# EAGLE design 20210419-JGaylord-doorman_adult_rig (EAGLE 9.6.2)
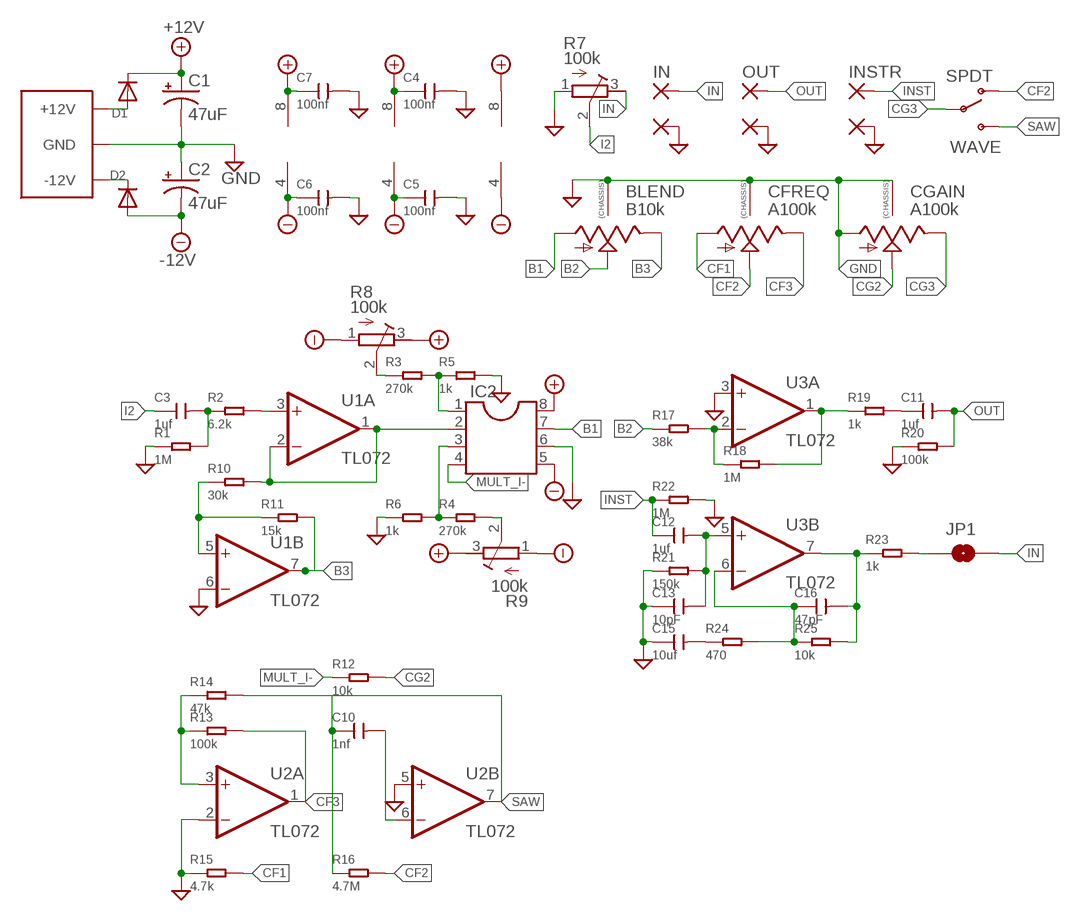
[diagram p0: schematic, sheet 1]

## Parts
BLEND  B10k  9MM_SNAP-IN_POT_CHASSIS  [9MM_SNAP-IN_POT]
C1  47uF  CAP_SMD+THRUPAN_B  [PAN_B_SMD+THRU]
C2  47uF  CAP_SMD+THRUPAN_B  [PAN_B_SMD+THRU]
C3  1uf  CERAMIC-10UF-25V-10%-X5R(1206)  [C1206]
C4  100nf  CERAMIC-100NF-50V-10%-X7R(0805)  [C0805]
C5  100nf  CERAMIC-100NF-50V-10%-X7R(0805)  [C0805]
C6  100nf  CERAMIC-100NF-50V-10%-X7R(0805)  [C0805]
C7  100nf  CERAMIC-100NF-50V-10%-X7R(0805)  [C0805]
C10  1nf  CERAMIC-100NF-50V-10%-X7R(0805)  [C0805]
C11  1uf  CERAMIC-10UF-25V-10%-X5R(1206)  [C1206]
C12  1uf  CERAMIC-10UF-25V-10%-X5R(1206)  [C1206]
C13  10pF  CERAMIC-100NF-50V-10%-X7R(0805)  [C0805]
C15  10uf  CERAMIC-10UF-25V-10%-X5R(1206)  [C1206]
C16  47pF  CERAMIC-100NF-50V-10%-X7R(0805)  [C0805]
CFREQ  A100k  9MM_SNAP-IN_POT_CHASSIS  [9MM_SNAP-IN_POT]
CGAIN  A100k  9MM_SNAP-IN_POT_CHASSIS  [9MM_SNAP-IN_POT]
D1  DIODESOD-123  [SOD-123]
D2  DIODESOD-123  [SOD-123]
GND  WIREPAD1,6/0,9  [1,6/0,9]
GND1  WIREPAD1,6/0,9  [1,6/0,9]
GND2  WIREPAD1,6/0,9  [1,6/0,9]
IC2  DIL8  [DIL08]
IN  WIREPAD1,6/0,9  [1,6/0,9]
INSTR  WIREPAD1,6/0,9  [1,6/0,9]
JP1  JUMPER-SMT_2_NO_NO-SILK  [SMT-JUMPER_2_NO_NO-SILK]
OUT  WIREPAD1,6/0,9  [1,6/0,9]
R1  1M  SMD-RES-1K-5%-1/8W(0805)  [R0805]
R2  6.2k  SMD-RES-1K-5%-1/8W(0805)  [R0805]
R3  270k  SMD-RES-1K-5%-1/8W(0805)  [R0805]
R4  270k  SMD-RES-1K-5%-1/8W(0805)  [R0805]
R5  1k  SMD-RES-1K-5%-1/8W(0805)  [R0805]
R6  1k  SMD-RES-1K-5%-1/8W(0805)  [R0805]
R7  100k  R-TRIMM3224W  [RTRIM3224W]
R8  100k  R-TRIMM3224W  [RTRIM3224W]
R9  100k  R-TRIMM3224W  [RTRIM3224W]
R10  30k  SMD-RES-1K-5%-1/8W(0805)  [R0805]
R11  15k  SMD-RES-1K-5%-1/8W(0805)  [R0805]
R12  10k  SMD-RES-1K-5%-1/8W(0805)  [R0805]
R13  100k  SMD-RES-1K-5%-1/8W(0805)  [R0805]
R14  47k  SMD-RES-1K-5%-1/8W(0805)  [R0805]
R15  4.7k  SMD-RES-1K-5%-1/8W(0805)  [R0805]
R16  4.7M  SMD-RES-1K-5%-1/8W(0805)  [R0805]
R17  38k  SMD-RES-1K-5%-1/8W(0805)  [R0805]
R18  1M  SMD-RES-1K-5%-1/8W(0805)  [R0805]
R19  1k  SMD-RES-1K-5%-1/8W(0805)  [R0805]
R20  100k  SMD-RES-1K-5%-1/8W(0805)  [R0805]
R21  150k  SMD-RES-1K-5%-1/8W(0805)  [R0805]
R22  1M  SMD-RES-1K-5%-1/8W(0805)  [R0805]
R23  1k  SMD-RES-1K-5%-1/8W(0805)  [R0805]
R24  470  SMD-RES-1K-5%-1/8W(0805)  [R0805]
R25  10k  SMD-RES-1K-5%-1/8W(0805)  [R0805]
U1  TL072  TL072TSSOP  [TSSOP-8]
U2  TL072  TL072TSSOP  [TSSOP-8]
U3  TL072  TL072TSSOP  [TSSOP-8]
U$1  EURO_POWER_LOCK  [EURO_PWR_HEADER_LOCK]
WAVE  SPDT  SUBMINI_SPDT  [SUBMINI_TOGGLE]

## Nets
+12V: C1.+ C1.++(+) C4.1 C7.1 D1.C IC2.8 R8.3(E) R9.3(E) U1.8(P:V+) U2.8(P:V+) U3.8(P:V+)
-12V: C2.- C2.--(-) C5.1 C6.1 D2.A IC2.5 R8.1(A) R9.1(A) U1.4(P:V-) U2.4(P:V-) U3.4(P:V-)
B1: BLEND.1(A) IC2.7
B2: BLEND.2(S) R17.1
B3: BLEND.3(E) R11.2 U1.7(B:OUT)
CF1: CFREQ.1(A) R15.2
CF2: CFREQ.2(S) R16.2 WAVE.1(O)
CF3: CFREQ.3(E) R13.2 U2.1(A:OUT)
CG2: CGAIN.2(S) R12.2
CG3: CGAIN.3(E) WAVE.COM(COMMON)
GND: BLEND.CHASSIS1 BLEND.CHASSIS2 C1.- C1.--(-) C2.+ C2.++(+) C4.2 C5.2 C6.2 C7.2 C13.1 C15.1 CFREQ.CHASSIS1 CFREQ.CHASSIS2 CGAIN.1(A) CGAIN.CHASSIS1 CGAIN.CHASSIS2 GND1.1(P) GND2.1(P) GND.1(P) IC2.6 R1.1 R5.2 R6.1 R7.1(A) R15.1 R20.1 R21.1 R22.2 U1.6(B:-IN) U2.2(A:-IN) U2.5(B:+IN) U3.3(A:+IN) U$1.GND1(GND) U$1.GND2(GND) U$1.GND3(GND) U$1.GND4(GND) U$1.GND5(GND) U$1.GND6(GND)
I2: C3.1 R7.2(S)
IN: IN.1(P) JP1.2 R7.3(E)
INST: C12.1 INSTR.1(P) R22.1
MULT_I-: IC2.4 R12.1
N$1: D1.A U$1.POS1(+12V) U$1.POS2(+12V)
N$2: D2.C U$1.NEG1(-12V) U$1.NEG2(-12V)
N$3: C3.2 R1.2 R2.1
N$4: R2.2 U1.3(A:+IN)
N$5: IC2.2 R10.2 U1.1(A:OUT) U1.2(A:-IN)
N$6: R10.1 R11.1 U1.5(B:+IN)
N$7: IC2.1 R3.2 R5.1
N$8: R3.1 R8.2(S)
N$9: IC2.3 R4.1 R6.2
N$10: R4.2 R9.2(S)
N$11: C11.1 R19.2
N$12: R13.1 R14.1 U2.3(A:+IN)
N$13: C15.2 R24.1
N$14: R18.2 R19.1 U3.1(A:OUT)
N$15: C10.2 U2.6(B:-IN)
N$16: R17.2 R18.1 U3.2(A:-IN)
N$17: C12.2 C13.2 R21.2 U3.5(B:+IN)
N$18: C16.1 R24.2 R25.1 U3.6(B:-IN)
N$20: C16.2 R23.1 R25.2 U3.7(B:OUT)
N$21: JP1.1 R23.2
OUT: C11.2 OUT.1(P) R20.2
SAW: C10.1 R14.2 R16.1 U2.7(B:OUT) WAVE.3(S)

## Library data of the parts
BLEND CFREQ CGAIN = MusicThingModular:9MM_SNAP-IN_POT_CHASSIS: 9mm vertical snap-in pot, Alpha / Panasonic style, with a connection to the metal chassis for grounding
C1 C2 = MusicThingModular:CAP_SMD+THRU
C3 C11 C12 = OPL_Capacitor:CERAMIC-10UF-25V-10%-X5R(1206): 302010181; MPN: CC1206KKX5R8BB106; VALUE: 10uf
C4-C7 = OPL_Capacitor:CERAMIC-100NF-50V-10%-X7R(0805): 302010165; MPN: CC0805KRX7R9BB104
C10 C13 C16 = OPL_Capacitor:CERAMIC-100NF-50V-10%-X7R(0805): 302010165; MPN: CC0805KRX7R9BB104; VALUE: 100nf
C15 = OPL_Capacitor:CERAMIC-10UF-25V-10%-X5R(1206): 302010181; MPN: CC1206KKX5R8BB106
D1 D2 = adafruit:DIODE: Diode SMADIODE - SMA Surface Mount Package 20V 1A Schottky Diode Digikey: 641-1014-6-ND DO-1N4148 - Through Hole Small Current Diode SOD-123 20V 1 A (.5mV Vf) Schottky Diode - Digikey: MBRX120TPMSCT-ND SOD-323 10V 570mA (.38mV Vf, 3ns) Schottky Diode - Digikey: ZLLS410CT-ND SOD-523 30V 30mA Schottky Diode (RB751S-40TE61) - Digikey: RB751S-40TE61CT-ND SOT23-R/W - SOT23 Package (R = Solder Paste/Reflow Ovens, W = Hand-Soldering) BAT54Film 40V 300mA - Digikey: 497-7162-1-ND
GND GND1 GND2 IN INSTR OUT = wirepad:WIREPAD: Wire PAD connect wire on PCB
IC2 = ic-package:DIL8: Dual In Line / Socket
JP1 = SparkFun-Jumpers:JUMPER-SMT_2_NO: Normally open jumper This jumper has two pads in close proximity to each other. Apply solder to close the connection. Round pads are easier to solder for beginners, but are a lot larger. SparkFun Product that uses the round pads: SparkFun EL Sequencer <https://www.sparkfun.com/products/12781>
R1-R6 R10-R25 = OPL_Resistor:SMD-RES-1K-5%-1/8W(0805): 301012189; MPN: RC0805JR-071KL; VALUE: 1K
R7-R9 = rcl:R-TRIMM: Trimm resistor; SPICEMODEL: X; SPICEPREFIXL: POT
U1-U3 = MusicThingModular:TL072: Generic Dual Op Amp
U$1 = MusicThingModular:EURO_POWER_LOCK
WAVE = MusicThingModular:SUBMINI_SPDT

## Board
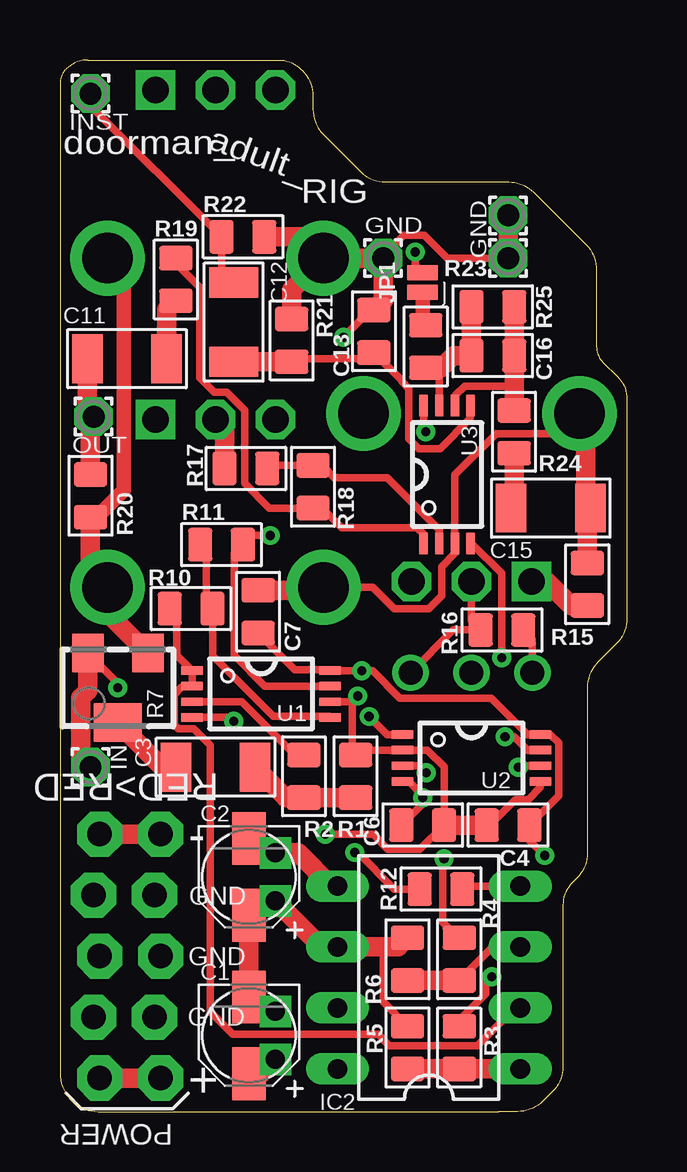
[diagram p1: board, top side]
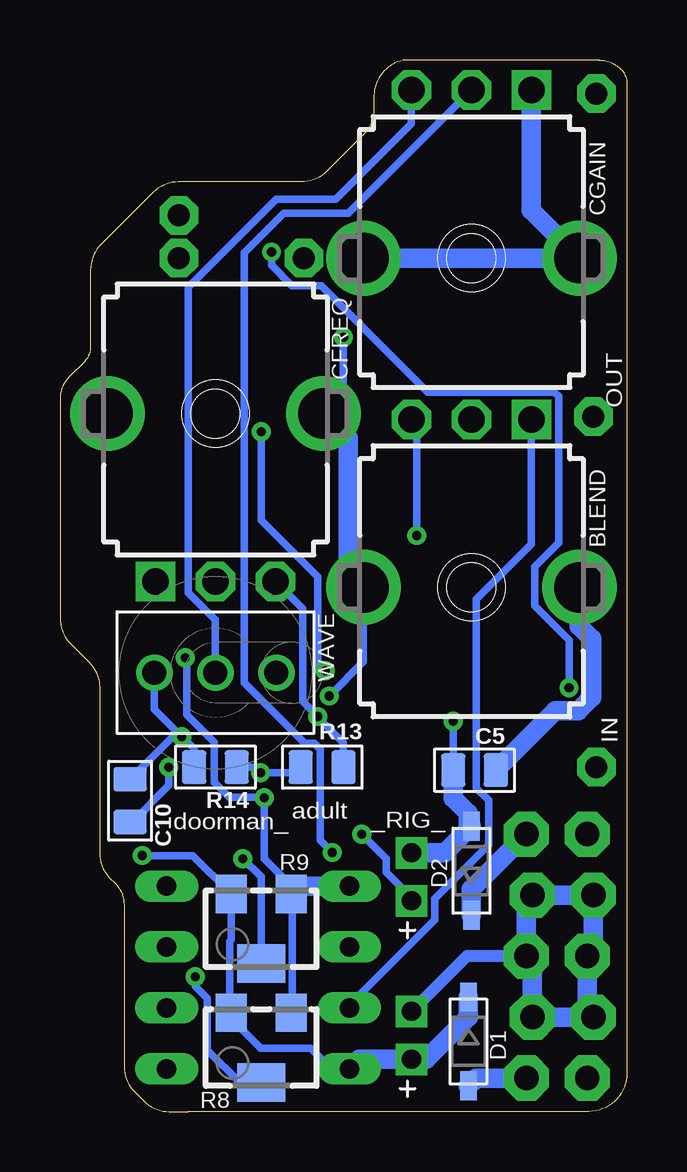
[diagram p2: board, bottom side, seen from below]

Size 23.62 x 43.81 mm. Coordinates in mm from the lower left corner, seen from the top.
Outline: 0,41.78 0,1.6 arc90 1.6,0 18.29,0 19.07,0 arc45 20.12,0.43 20.52,0.84 arc45 20.95,1.88 20.95,8.61 arc-45 21.34,9.53 21.54,9.73 arc45 21.97,10.77 21.97,17.68 arc-45 22.4,18.72 23.19,19.51 arc45 23.62,20.55 23.62,29.69 arc45 23.24,30.61 22.62,31.23 arc-45 22.35,31.88 22.35,35.08 arc45 21.92,36.12 19.73,38.3 arc45 18.69,38.73 13.56,38.73 arc-45 12.52,39.17 10.97,40.72 arc-45 10.54,41.76 10.54,42.32 arc45 10.11,43.36 10.03,43.43 arc45 9.11,43.81 1.16,43.81 arc45 0.26,43.44 0.25,43.43 arc45 0,42.82 0,41.78
Copper layers (1*16): Top 0.035mm / dielectric 1.5mm / Bottom 0.035mm
Design rules "default *": minimum track width 6mil, minimum drill 0.35mm, track to track 6mil, track to pad 6mil, pad to pad 6mil, via to via 6mil, smd to smd 6mil, copper to edge 16mil, drill to drill 6mil, minimum pad ring 10mil, minimum via ring 8mil, stop-mask expansion 4mil, vias tented up to drill 0mil, thermal gap 10mil

### Footprints (pad centres in the part's own frame; a part is rotated, then mirrored left to right if it is on the bottom)
9MM_SNAP-IN_POT = drill 1.1 square: 1 -2.5,-7 | drill 1.1 octagon: 2 0,-7; 3 2.5,-7 | drill 2.1 pad 2.794: CHASSIS1 -4.5,0; CHASSIS2 4.5,0
PAN_B_SMD+THRU = smd 2.2 x 1.4: + 1.6,0; - -1.6,0 | drill 0.8 pad 0.9 square: ++ 1,1.1; -- -1,1.1
C1206 = smd 1.27 x 2.032: 1 -1.651,0; 2 1.651,0
C0805 = smd 1.397 x 1.016: 1 0,0.889; 2 0,-0.889
SOD-123 = smd 1.2 x 0.7: A 1.85,0; C -1.85,0
1,6/0,9 = drill 0.914 pad 1.6 octagon: 1 0,0
DIL08 = drill 0.813 long: 1 -3.81,-3.81; 2 -1.27,-3.81; 3 1.27,-3.81; 4 3.81,-3.81; 5 3.81,3.81; 6 1.27,3.81; 7 -1.27,3.81; 8 -3.81,3.81
SMT-JUMPER_2_NO_NO-SILK = smd 0.635 x 1.27: 1 -0.406,0; 2 0.406,0
R0805 = smd 1.397 x 1.016: 1 0,0.889; 2 0,-0.889
RTRIM3224W = smd 1.3 x 1.6: 1 -1.25,-1.45; 3 1.25,-1.45 | smd 2 x 1.6: 2 0,1.45
TSSOP-8 = smd 0.9 x 0.35: 1 -2.875,0.975; 2 -2.875,0.325; 3 -2.875,-0.325; 4 -2.875,-0.975; 5 2.875,-0.975; 6 2.875,-0.325; 7 2.875,0.325; 8 2.875,0.975
EURO_PWR_HEADER_LOCK = drill 1.016 pad 1.88 octagon: GND1 -2.54,1.143; GND2 -2.54,-1.397; GND3 0,1.397; GND4 0,-1.143; GND5 2.54,1.143; GND6 2.54,-1.397; NEG1 -5.08,1.397; NEG2 -5.08,-1.143; POS1 5.08,1.397; POS2 5.08,-1.143
SUBMINI_TOGGLE = drill 1 pad 1.422: 1 -2.54,0; 3 2.54,0; COM 0,0

### Placement (x,y rotation side)
BLEND  6.48,21.84 180 bottom
C1  7.87,3.17 270 top
C2  7.87,9.78 270 top
C3  6.48,14.35 0 top
C4  18.67,11.94 270 top
C5  6.35,14.22 90 bottom
C6  15.11,11.94 90 top
C7  8.26,20.83 180 top
C10  20.7,12.95 0 bottom
C11  2.79,31.37 180 top
C12  7.24,32.89 270 top
C13  13.08,32.51 0 top
C15  20.45,25.15 180 top
C16  18.03,31.5 270 top
CFREQ  17.14,29.08 0 bottom
CGAIN  6.48,35.56 180 bottom
D1  6.6,2.92 270 bottom
D2  6.48,10.03 90 bottom
GND  18.67,35.56 0 top
GND1  18.67,37.34 0 top
GND2  13.46,35.56 0 top
IC2  15.37,5.59 90 top
IN  1.27,14.35 0 top
INSTR  1.27,42.42 0 top
JP1  15.11,34.54 90 top
OUT  1.4,28.96 0 top
R1  12.32,13.97 0 top
R2  10.16,13.97 180 top
R3  16.64,2.67 0 top
R4  16.64,6.35 180 top
R5  14.48,2.67 180 top
R6  14.48,6.35 0 top
R7  2.41,17.65 180 top
R8  15.24,2.67 180 bottom
R9  15.24,7.62 180 bottom
R10  5.46,20.95 270 top
R11  6.73,23.62 90 top
R12  15.88,9.27 270 top
R13  12.7,14.35 90 bottom
R14  17.14,14.35 270 bottom
R15  21.97,21.97 0 top
R16  18.41,20.07 270 top
R17  7.75,26.8 90 top
R18  10.54,26.04 0 top
R19  4.83,34.67 0 top
R20  1.27,25.65 180 top
R21  9.65,32.13 0 top
R22  7.62,36.45 90 top
R23  15.24,31.88 180 top
R24  18.92,28.32 180 top
R25  18.03,33.53 270 top
U1  8.38,17.4 0 top
U2  17.14,14.73 0 top
U3  16.13,26.54 90 top
U$1  2.79,6.48 270 top
WAVE  17.14,18.29 180 bottom

### Tracks (layer width: path | path; a pad name or v marks a point on that pad's centre or on a via)
+12V  (via drill 0.38)
  Top 0.305: U3.8 15.15,28.41 v15.24,28.32 | v20.19,10.67 19.56,11.3 C4.1 20.77,13.15 20.77,15.36 20.43,15.71 U2.8 19.48,15.71 17.96,17.23 14.17,17.23 13.02,18.37 v12.57,18.37 U1.8 11.22,18.41 9.78,18.41 C7.1
  Top 0.813: C1.+ 8.37,1.57 C1.++
  Bottom 0.305: v20.19,10.67 18.09,10.67 R9.3 16.49,7.15 16.55,7.1 16.55,4.17 R8.3 16.49,3.86 15.26,2.63 13.17,2.63 12.32,1.78 IC2.8 | v15.24,28.32 15.24,24.64 12.88,22.28 12.88,18.68 v12.57,18.37
  Bottom 0.813: D1.C 6.6,3.94 8.37,2.17 C1.++ 11.16,2.17 IC2.8
-12V  (via drill 0.38)
  Top 0.305: U2.4 14.52,13.76 15.11,13.17 v15.11,13.08 15.11,12.83 C6.1 | v7.24,16.26 7.11,16.38 7.07,16.38 7.03,16.42 U1.4 | v18.4,18.91 18.4,22.42 17.16,23.67 U3.4
  Top 0.813: C2.- 8.47,10.78 C2.-- 9.92,10.78 11.3,9.4 IC2.5
  Bottom 0.305: R8.1 13.94,4.17 13.94,9.02 R9.1 13.99,9.42 15.11,10.54 v15.11,13.08 15.13,13.09 16.56,13.09 17.2,13.73 17.2,15.39 18.33,16.52 18.33,18.84 v18.4,18.91 | C5.1 v7.24,16.26
  Bottom 0.813: C2.-- 7.58,10.78 D2.A 6.6,12.01 6.6,12.43 7.24,13.06 C5.1 | R9.1 13.66,9.4 IC2.5
B1
  Bottom 0.305: BLEND.1 3.98,23.64 6.27,21.34 6.27,13.47 5.77,12.97 5.77,11.12 8.02,8.87 8.02,8 11.56,4.46 IC2.7
B2
  Top 0.813: R17.1 6.86,28.46 BLEND.2
B3  (via drill 0.38)
  Top 0.305: v8.76,24 8,24 R11.2 7.25,23.25 7.25,19.01 8.54,17.72 U1.7
  Bottom 0.305: v8.76,24 8.76,28.63 BLEND.3
CF1
  Top 0.813: R15.2 21.96,21.07 21.29,21.07 20.28,22.08 CFREQ.1
CF2
  Top 0.305: WAVE.1 16.38,20.07 R16.2 17.14,20.45 CFREQ.2
CF3  (via drill 0.38)
  Top 0.305: U2.1 13.63,15.71 v12.88,16.46
  Bottom 0.305: R13.2 11.81,15.37 12.88,16.43 v12.88,16.46 13.51,17.09 13.51,19.43 13.5,19.42 13.5,20.94 CFREQ.3
CG2  (via drill 0.38)
  Top 0.305: R12.2 13.93,9.27 12.4,10.79 v12.28,10.79
  Bottom 0.305: CGAIN.2 11.61,37.43 14.3,37.43 15.94,35.79 15.94,17.87 13.42,15.35 13.03,15.35 12.78,15.1 12.78,11.3 v12.28,10.79
CG3
  Bottom 0.305: CGAIN.3 8.98,41.16 12.13,38.01 14.62,38.01 18.27,34.35 18.27,21.61 17.14,20.48 WAVE.COM
GND  (via drill 0.38)
  Top 0.305: C4.2 17.91,11.94 18.96,12.99 19.51,12.99 20.02,13.5 U2.5 | GND2.1 13.46,35.66 14.32,36.51 15.18,36.51 16.13,35.56 GND.1 | CFREQ.CHASSIS1 20.81,28.25 18.17,28.25 16.45,26.53 U3.3 16.45,23.26 15.9,22.71 15.9,21.49 15.37,20.95 13.92,20.95 13.03,21.84 BLEND.CHASSIS2 | R5.2 13.46,4.57 13.46,6.86 | v11.05,11.56 13.04,11.56 13.66,10.94 15,10.94 C6.2 16,14.37 15.31,15.06 U2.2 12.52,15.06 R1.1 12.18,15 12.18,17.07 12.17,17.07 | v12.4,17.32 v12.4,17.31 12.17,17.07 | U1.6 12.17,17.07 | C13.1 12.95,33.4 v11.81,32.26
  Top 0.61: CGAIN.CHASSIS1 1.98,35.37 2.65,34.7 2.65,25.89 1.52,24.77 R20.1
  Top 0.813: C1.-- 8.47,4.17 C1.- C2.+ 8.47,8.78 C2.++ 10.89,6.86 IC2.6 13.46,6.86 14.1,6.86 R6.1 | C4.2 C6.2 | C7.2 10.85,21.72 BLEND.CHASSIS2 | R7.1 1.98,20.79 BLEND.CHASSIS1 1.27,22.55 R20.1 | R22.2 10.09,36.45 CGAIN.CHASSIS2 | CGAIN.CHASSIS2 GND2.1 13.46,33.78 C13.1 | R21.1 9.65,34.23 CGAIN.CHASSIS2 | GND1.1 GND.1 | CFREQ.CHASSIS1 21.9,28.83 21.9,25.34 C15.1 21.97,25.02 R15.1
  Bottom 0.305: v11.05,11.56 10.03,10.54 10.03,9.97 8.97,8.91 C2.++ | v12.4,17.32 10.98,18.74 BLEND.CHASSIS2 | v11.81,32.26 11.81,29.92 CFREQ.CHASSIS2
  Bottom 0.508: U$1.GND3 6.67,6.48 C1.--
  Bottom 0.813: CGAIN.1 3.98,37.56 CGAIN.CHASSIS1 CGAIN.CHASSIS2 | BLEND.CHASSIS2 11.62,22.49 11.62,28.06 CFREQ.CHASSIS2 | BLEND.CHASSIS1 1.98,20.21 1.46,19.7 1.46,17.26 2.02,16.7 2.98,16.7 C5.2 | U$1.GND5 3.94,6.22 U$1.GND3 4.19,8.76 U$1.GND1 U$1.GND2 1.4,6.73 U$1.GND4 1.65,4.19 U$1.GND6 U$1.GND5
I2
  Top 0.813: C3.1 4.26,14.35 R7.2
IN  (via drill 0.38)
  Top 0.305: R7.3 2.41,17.85 v2.41,17.65 | v14.81,35.81 14.81,35.26 JP1.2
  Top 0.813: R7.3 1.16,17.54 0.85,17.23 0.85,14.77 IN.1
  Bottom 0.305: v2.41,17.65 2.41,19.65 3.84,21.07 3.84,22.71 2.85,23.7 2.85,29.8 3.03,29.97 8.29,29.97 12.74,34.42 13.97,34.42 14.81,35.26 v14.81,35.81
INST
  Top 0.305: C12.1 6.73,35.05 R22.1 1.27,41.91 INSTR.1
MULT_I-
  Top 0.305: R12.1 16.89,9.4 IC2.4
N$1
  Top 0.813: U$1.POS2 U$1.POS1
  Bottom 0.813: U$1.POS1 6.28,1.4 D1.A
N$2
  Top 0.813: U$1.NEG2 U$1.NEG1
  Bottom 0.813: U$1.NEG1 6.48,9.27 D2.C
N$3
  Top 0.813: R1.2 R2.1 9.4,13.08 C3.2
N$4
  Top 0.305: U1.3 7.56,17.07 9.78,14.86 R2.2
N$5
  Top 0.305: R10.2 4.57,20.71 4.87,20.41 4.87,19.01 U1.1 U1.2 5.13,17.72 5.08,17.68 5.06,17.68 4.75,17.38 4.75,16.12 4.93,15.94 5.57,15.94 6.25,15.26 6.25,4.16 7.2,3.22 13.26,3.22 13.73,2.74 17.39,2.74 18.96,4.32 IC2.2
N$6
  Top 0.305: R11.1 6.1,23.37 6.1,21.59 6.35,21.34 R10.1 6.36,20.94 6.36,19 8.89,16.47 11.21,16.47 U1.5
N$7
  Top 0.813: R5.1 R3.2 IC2.1
N$8  (via drill 0.38)
  Top 0.305: R3.1 16.64,3.81 17.73,4.9 17.73,5.36 v17.98,5.61
  Bottom 0.305: v17.98,5.61 17.98,5.23 17.48,4.72 17.48,2.56 16.13,1.22 R8.2
N$9
  Top 0.305: R4.1 18.03,6.86 IC2.3
  Top 0.813: R6.2 R4.1
N$10  (via drill 0.38)
  Top 0.305: v16,10.54 15.95,10.49 15.95,7.89 16.6,7.24 R4.2
  Bottom 0.305: R9.2 15.24,9.78 v16,10.54
N$11
  Top 0.813: C11.1 4.45,33.4 R19.2
N$12  (via drill 0.38)
  Top 0.305: U2.3 14.97,14.41 v15.27,14.11
  Bottom 0.305: R14.1 15.5,14.35 v15.27,14.11 13.83,14.11 R13.1
N$13
  Top 0.813: R24.1 18.92,25.27 C15.2
N$14
  Top 0.305: U3.1 15.15,24.05 14.87,24.33 11.73,24.33 10.92,25.15 R18.2 8.72,25.15 7.7,26.17 7.7,29.22 6.95,29.97 6.42,29.97 5.83,30.57 5.83,34.34 4.83,35.34 R19.1
N$15  (via drill 0.38)
  Top 0.305: U2.6 19.14,14.41 v19.09,14.35
  Bottom 0.305: v19.09,14.35 19.09,13.59 20.61,12.06 C10.2
N$16
  Top 0.305: U3.2 15.8,24.24 13.63,26.42 11.43,26.42 10.92,26.92 R18.1 8.76,26.92 R17.2
N$17
  Top 0.305: R21.2 9.78,31.37 12.83,31.37 C13.2 14.24,30.47 14.24,30.43 14.54,30.12 14.54,28.03 14.95,27.62 15.84,27.62 17.1,28.89 U3.5
  Top 0.813: C12.2 R21.2
N$18
  Top 0.305: U3.6 16.5,29.46 16.5,29.87 16.86,30.23 18.92,30.23
  Top 0.813: R25.1 C16.1 18.92,30.23 R24.2
N$20
  Top 0.305: U3.7 15.8,30.92 15.88,30.99
  Top 0.813: R23.1 15.88,30.99 16.38,31.5 C16.2 R25.2
N$21
  Top 0.61: JP1.1 15.11,32.89
  Top 0.813: 15.11,32.89 R23.2
OUT
  Top 0.813: R20.2 1.27,28.83 OUT.1 1.14,29.21 C11.2
SAW  (via drill 0.38)
  Top 0.305: U2.7 19.49,15.06 18.92,15.62 v18.54,15.62 | WAVE.3 19.68,19.68 R16.1
  Bottom 0.305: 18.67,15.75 v18.54,15.62 18.03,15.11 R14.2 | 18.67,15.75 19.68,16.76 WAVE.3 | C10.1 18.8,15.75 18.67,15.75

### Text on the board
tPlace: INST | doorman_ | adult_ | RIG | GND | GND | OUT | IN
bPlace: OUT | IN | _RIG_ | adult | doorman_